# EasyEDA Pro project schematic of PCB.epro

# Schematic DESKPET
Board Name: DESKPET; Create Date: 2025-02-04; Page Name: Sheet_1; Project Name: DESKPET_2025-02-04_14-17-01; Schematic Name: DESKPET; Update Date: 2025-02-19; Company: EasyEDA.com; Page Size: A1; Version: V1.0
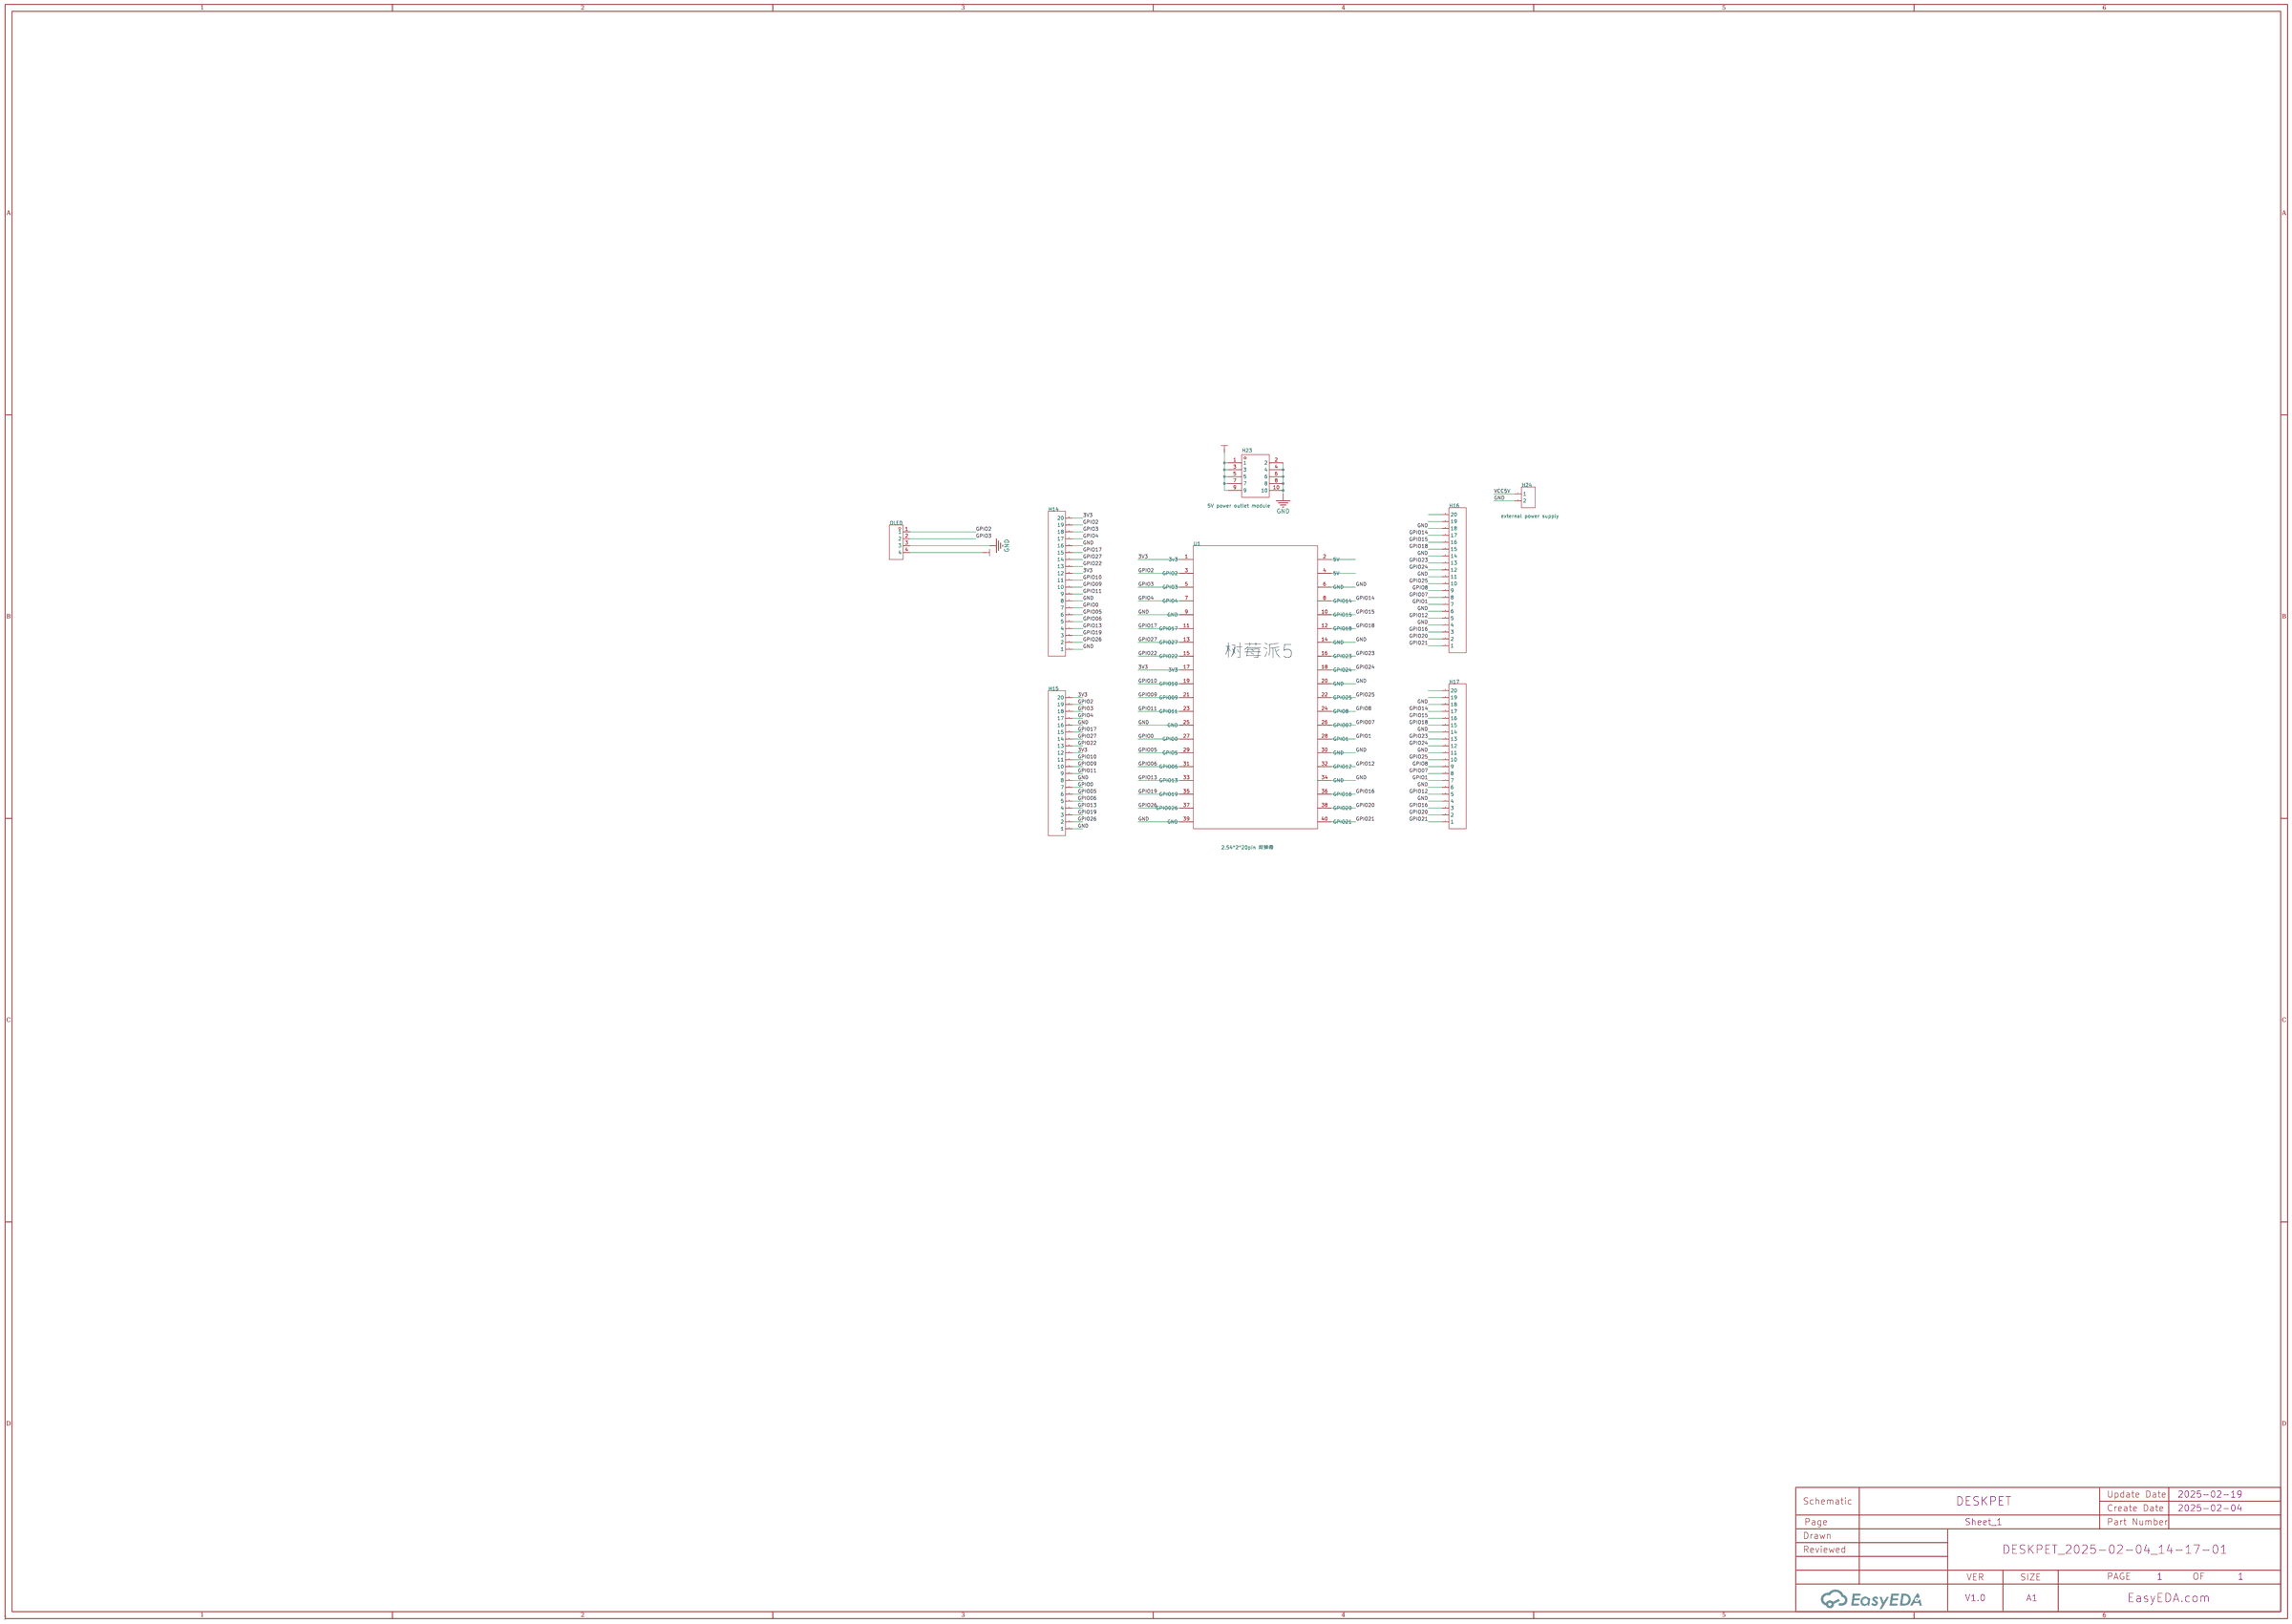
[diagram p0: schematic sheet]

## Parts
H3  OLED  [HDR-TH_4P-P2.54-V-F]
H14  -  [HDR-TH_20P-P2.54-V-F]
H15  -  [HDR-TH_20P-P2.54-V-F]
H16  -  [HDR-TH_20P-P2.54-V-F]
H17  -  [HDR-TH_20P-P2.54-V-F]
H23  5V power outlet module  [HDR-TH_10P-P2.54-V-M-R2-C5-S2.54]
H24  external power supply  [HDR-TH_2P-P2.54-V-F]
U1  2.54*2*20pin 双排母  [raspberripi5]

## Library data of the parts
H3 = 2.54-1*4P母: Holes Structure:1x4P Pitch:2.54mm Row Spacing:- Circular Hole / Square Hole:Square Holes Mounting Type:Straight Number of Rows:Plugin Number of Holes:4P Current Rating (Max):3A Voltage Rating (Max):- Holes Direction:Top Insulation Height:- Contact Materia; LCSC Part Name: 间距:2.54mm 1x4P 直插; Supplier Part: C2718488; Manufacturer: BOOMELE(博穆精密); Supplier Footprint: 插件,P=2.54mm; JLCPCB Part Class: 扩展库; Datasheet: https://atta.szlcsc.com/upload/public/pdf/source/20210301/C2718488_F4427B881E42CAA8DDB0B1C12B3A522C.pdf; Supplier: LCSC; Holes Structure: 1x4P; Pitch: 2.54mm; Circular Hole / Square Hole: Square Holes; Mounting Type: Straight; Number of Rows: Plugin; Number of Holes: 4P; Current Rating (Max): 3A; Holes Direction: Top; Contact Material: bronze; Operating Temperature Range: -40℃~+105℃
H14-H17 = HDR-F_2.54_1x20P: Supplier Part: C50984; Supplier Footprint: 插件
H23 = HDR-M_2.54_2x5: Supplier Part: C124387; Supplier Footprint: 插件,P=2.54mm
H24 = HDR-F_2.54_1x2P: Supplier Part: C49661; Supplier Footprint: 插件
U1 = Rasperberry 5 GPIO

## Nets
3V3: H3.4 H14.12 H14.20 H15.12 H15.20 U1.1(3v3) U1.17(3V3)
5V: H23.1 H23.3 H23.5 H23.7 H23.9
GND: H3.3 H14.1 H14.8 H14.16 H15.1 H15.8 H15.16 H16.4 H16.6 H16.11 H16.14 H16.18 H17.4 H17.6 H17.11 H17.14 H17.18 H23.2 H23.4 H23.6 H23.8 H23.10 H24.2 U1.6(GND) U1.9(GND) U1.14(GND) U1.20(GND) U1.25(GND) U1.30(GND) U1.34(GND) U1.39(GND)
VCC5V: H24.1
GPIO0: H14.7 H15.7 U1.27(GPIO0)
GPIO1: H16.7 H17.7 U1.28(GPIO1)
GPIO2: H3.1 H14.19 H15.19 U1.3(GPIO2)
GPIO3: H3.2 H14.18 H15.18 U1.5(GPIO3)
GPIO4: H14.17 H15.17 U1.7(GPIO4)
GPIO05: H14.6 H15.6 U1.29(GPIO5)
GPIO06: H14.5 H15.5 U1.31(GPIO06)
GPIO07: H16.8 H17.8 U1.26(GPIO07)
GPIO8: H16.9 H17.9 U1.24(GPIO8)
GPIO09: H14.10 H15.10 U1.21(GPIO09)
GPIO10: H14.11 H15.11 U1.19(GPIO10)
GPIO11: H14.9 H15.9 U1.23(GPIO11)
GPIO12: H16.5 H17.5 U1.32(GPIO12)
GPIO13: H14.4 H15.4 U1.33(GPIO13)
GPIO14: H16.17 H17.17 U1.8(GPIO14)
GPIO15: H16.16 H17.16 U1.10(GPIO15)
GPIO16: H16.3 H17.3 U1.36(GPIO16)
GPIO17: H14.15 H15.15 U1.11(GPIO17)
GPIO18: H16.15 H17.15 U1.12(GPIO18)
GPIO19: H14.3 H15.3 U1.35(GPIO19)
GPIO20: H16.2 H17.2 U1.38(GPIO20)
GPIO21: H16.1 H17.1 U1.40(GPIO21)
GPIO22: H14.13 H15.13 U1.15(GPIO22)
GPIO23: H16.13 H17.13 U1.16(GPIO23)
GPIO24: H16.12 H17.12 U1.18(GPIO24)
GPIO25: H16.10 H17.10 U1.22(GPIO25)
GPIO26: H14.2 H15.2 U1.37(GPIO026)
GPIO27: H14.14 H15.14 U1.13(GPIO27)

Not connected (* = marked no-connect by the designer): H16 19 20; H17 19 20; U1 2(5V) 4(5V)

## Notes on the sheet
- 树莓派5

# Board PCB1
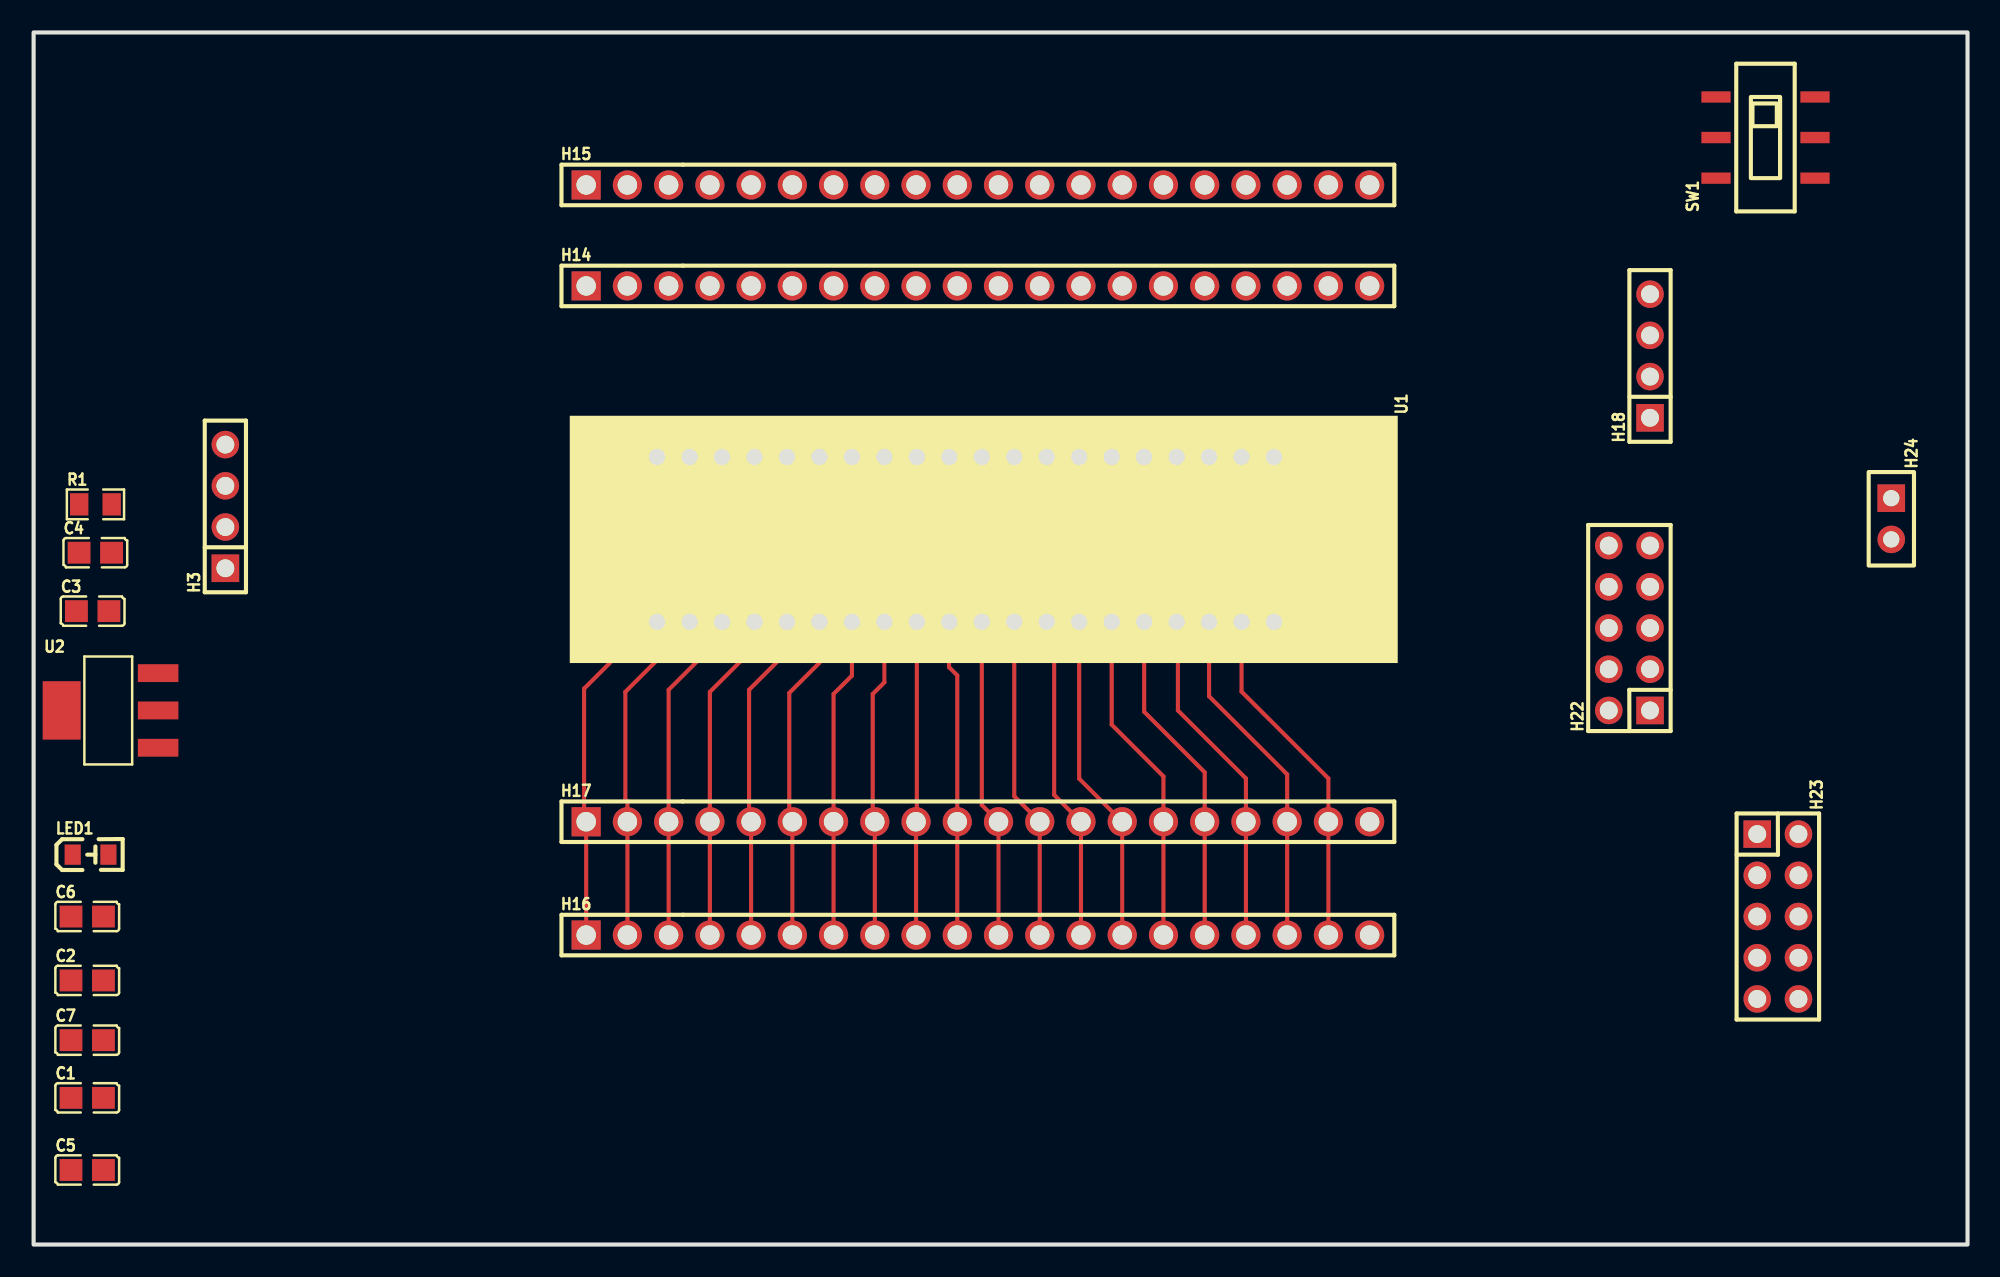
[diagram p1: board, top side]
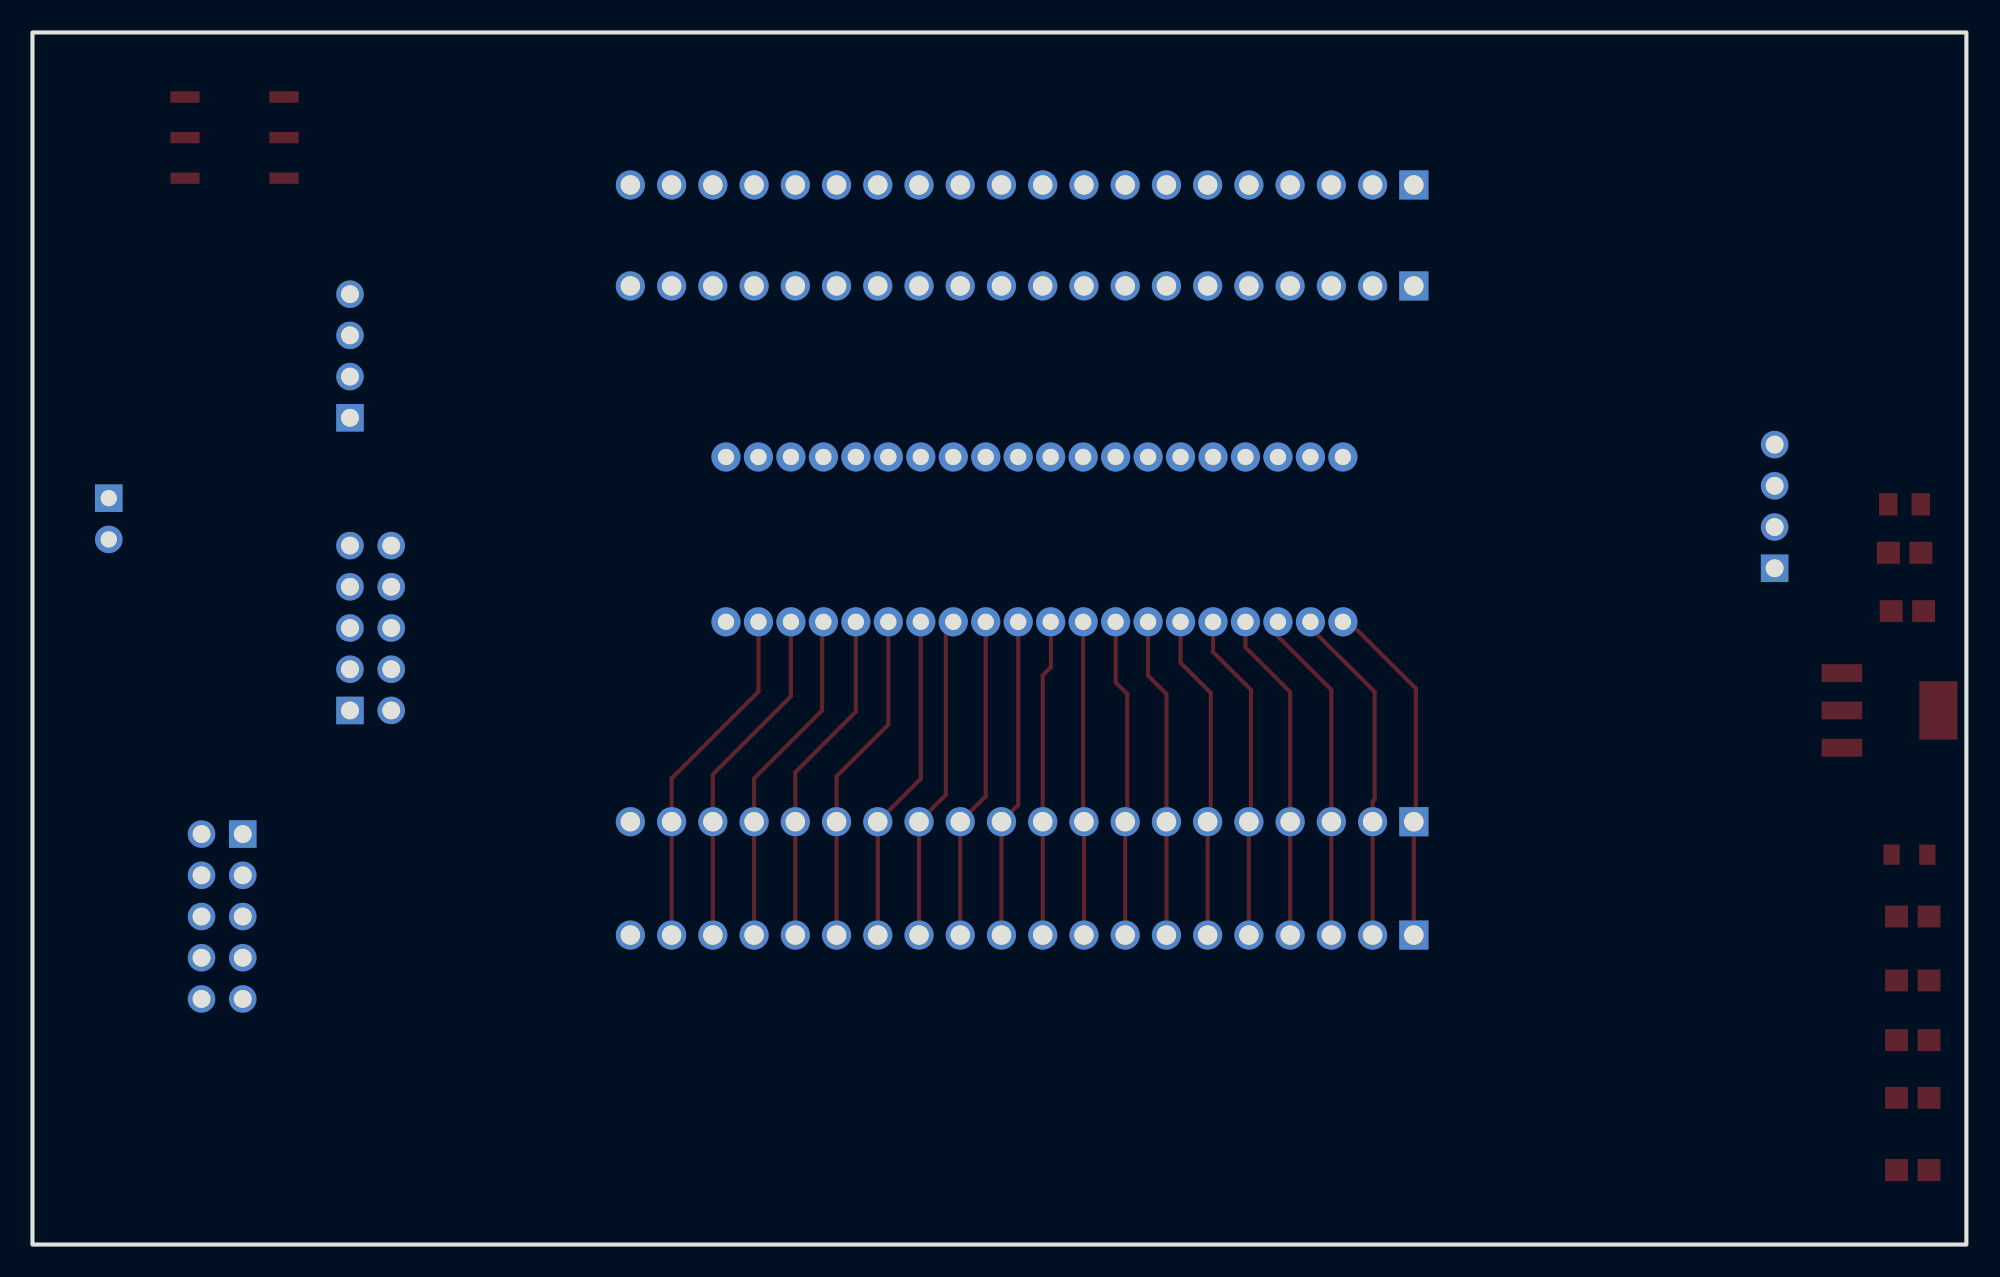
[diagram p2: board, bottom side, seen from below]

Outline 119.13 x 74.7 mm; copper layers: Top Layer, Bottom Layer. Coordinates in mm from the lower left corner of the outline.
Outline path: rectangle 0,74.7 119.13,0
Stack: Top Layer 0.035mm / Dielectric1 1.51mm FR4 er 4.5 / Bottom Layer 0.035mm

## Design rules (mm)
template: JLCPCB Capability(Two Layers Board)
spacing copperThickness1oz (default): track to track 0.102, other pairs 0.152 to 0.3
spacing copperThickness2oz: track to track 0.203, other pairs 0.152 to 0.3
track width copperThickness1oz (default): min 0.127, default 0.254, max 2.54
track width copperThickness2oz: min 0.203, default 0.254, max 2.54
differential pair differentialPair (default): width min 0.127, default 0.254, max 2.54; gap min 0.152, default 0.152
via viaSize (default): diameter min 0.5, default 0.61, max 10; hole min 0.3, default 0.305, max 6.3

## Placement (name value [footprint] x y rotation side)
C1  10UF  [C0805]  3.3 9.04 0 top
C2  100nF  [C0805]  3.3 16.28 0 top
C3  100nF  [C0805]  3.64 39.04 0 top
C4  10UF  [C0805]  3.8 42.64 0 top
C5  10UF  [C0805]  3.3 4.59 0 top
C6  10UF  [C0805]  3.3 20.22 0 top
C7  10UF  [C0805]  3.3 12.6 0 top
H3  OLED  [HDR-TH_4P-P2.54-V-F]  11.81 45.49 90 top
H14  -  [HDR-TH_20P-P2.54-V-F]  58.17 59.08 0 top
H15  -  [HDR-TH_20P-P2.54-V-F]  58.17 65.3 0 top
H16  -  [HDR-TH_20P-P2.54-V-F]  58.17 19.07 0 top
H17  -  [HDR-TH_20P-P2.54-V-F]  58.17 26.06 0 top
H18  su-03T speaking module  [HDR-TH_4P-P2.54-V-F]  99.57 54.76 90 top
H22  3.3V outlet module  [HDR-TH_10P-P2.54-V-M-R2-C5-S2.54]  98.3 38 90 top
H23  5V power outlet module  [HDR-TH_10P-P2.54-V-M-R2-C5-S2.54]  107.44 20.22 270 top
H24  external power supply  [HDR-TH_2P-P2.54-V-F]  114.43 44.73 270 top
LED1  -  [LED_0805]  3.56 24.03 0 top
R1  10K  [R0805]  3.81 45.62 0 top
SW1  SS-3235S-L1  [SW-SMD_SS-3235S-LX]  106.68 68.22 90 top
U1  2.54*2*20pin 双排母  [raspberripi5]  23.07 63.78 270 top
U2  AMS1117-3.3  [SOT-223-3_L6.5-W3.4-P2.30-LS7.0-BR]  4.7 32.92 0 top

## Footprints (pads in the part's own frame, mm; a bottom-side part is the same pattern mirrored in y, then rotated)
C0805
  rect 1.41x1.35 smd: 1(-1,0) 2(1,0)
HDR-TH_2P-P2.54-V-F
  rect 1.7x1.7 hole 1: 1(-1.27,0)
  round 1.7 hole 1: 2(1.27,0)
HDR-TH_4P-P2.54-V-F
  rect 1.7x1.7 hole 1.1: 1(-3.81,0)
  round 1.7 hole 1.1: 2(-1.27,0) 3(1.27,0) 4(3.81,0)
HDR-TH_10P-P2.54-V-M-R2-C5-S2.54
  rect 1.7x1.7 hole 1.1: 1(-5.08,-1.27)
  round 1.7 hole 1.1: 2(-5.08,1.27) 3(-2.54,-1.27) 4(-2.54,1.27) 5(0,-1.27) 6(0,1.27) 7(2.54,-1.27) 8(2.54,1.27) 9(5.08,-1.27) 10(5.08,1.27)
HDR-TH_20P-P2.54-V-F
  rect 1.8x1.8 hole 1.2: 1(-24.13,0)
  round 1.8 hole 1.2: 2(-21.59,0) 3(-19.05,0) 4(-16.51,0) 5(-13.97,0) 6(-11.43,0) 7(-8.89,0) 8(-6.35,0) 9(-3.81,0) 10(-1.27,0) 11(1.27,0) 12(3.81,0) 13(6.35,0) 14(8.89,0) 15(11.43,0) 16(13.97,0) 17(16.51,0) 18(19.05,0) 19(21.59,0) 20(24.13,0)
LED_0805
  rect 1x1.25 smd: 1(-1.15,0.005) 2(1.05,0.005)
R0805
  rect 1.133x1.377 smd: 1(-1,0) 2(1,0)
raspberripi5
  round 1.8 hole 1: 1(15.24,53.34) 2(25.4,53.34) 3(15.24,51.34) 4(25.4,51.34) 5(15.24,49.34) 6(25.4,49.34) 7(15.24,47.34) 8(25.4,47.34) 9(15.24,45.34) 10(25.4,45.34) 11(15.24,43.34) 12(25.4,43.34) 13(15.24,41.34) 14(25.4,41.34) 15(15.24,39.34) 16(25.4,39.34) 17(15.24,37.34) 18(25.4,37.34) 19(15.24,35.34) 20(25.4,35.34) 21(15.24,33.34) 22(25.4,33.34) 23(15.24,31.34) 24(25.4,31.34) 25(15.24,29.34) 26(25.4,29.34) 27(15.24,27.34) 28(25.4,27.34) 29(15.24,25.34) 30(25.4,25.34) 31(15.24,23.34) 32(25.4,23.34) 33(15.24,21.34) 34(25.4,21.34) 35(15.24,19.34) 36(25.4,19.34) 37(15.24,17.34) 38(25.4,17.34) 39(15.24,15.34) 40(25.4,15.34)
SOT-223-3_L6.5-W3.4-P2.30-LS7.0-BR
  rect 2.5x1.1 smd: 1(2.97,-2.3) 2(2.97,0) 3(2.97,2.3)
  rect 2.34x3.6 smd: 4(-2.97,0)
SW-SMD_SS-3235S-LX
  rect 0.7x1.8 smd: 1(-2.5,3.05) 2(0,3.05) 3(2.5,3.05) 4(-2.5,-3.05) 5(0,-3.05) 6(2.5,-3.05)

## Nets
3.3V: C3.2 C4.2 H3.4 H22.1 H22.3 H22.5 H22.7 H22.9 R1.1 U2.2 U2.4
3V3: H14.12 H14.20 H15.12 H15.20 U1.1 U1.17
5V: C1.2 C2.2 C5.2 C6.2 C7.2 H16.19 H16.20 H17.19 H17.20 H18.4 H23.1 H23.3 H23.5 H23.7 H23.9 SW1.5 SW1.6 U1.2 U1.4 U2.3
GND: C1.1 C2.1 C3.1 C4.1 C5.1 C6.1 C7.1 H3.3 H14.1 H14.8 H14.16 H15.1 H15.8 H15.16 H16.4 H16.6 H16.11 H16.14 H16.18 H17.4 H17.6 H17.11 H17.14 H17.18 H18.1 H22.2 H22.4 H22.6 H22.8 H22.10 H23.2 H23.4 H23.6 H23.8 H23.10 H24.2 LED1.1 SW1.1 SW1.2 SW1.3 U1.6 U1.9 U1.14 U1.20 U1.25 U1.30 U1.34 U1.39 U2.1
VCC5V: H24.1 SW1.4
GPIO0: H14.7 H15.7 U1.27
GPIO1: H16.7 H17.7 U1.28
GPIO2: H3.1 H14.19 H15.19 U1.3
GPIO3: H3.2 H14.18 H15.18 U1.5
GPIO4: H14.17 H15.17 U1.7
GPIO05: H14.6 H15.6 U1.29
GPIO06: H14.5 H15.5 U1.31
GPIO07: H16.8 H17.8 U1.26
GPIO8: H16.9 H17.9 U1.24
GPIO09: H14.10 H15.10 U1.21
GPIO10: H14.11 H15.11 U1.19
GPIO11: H14.9 H15.9 U1.23
GPIO12: H16.5 H17.5 U1.32
GPIO13: H14.4 H15.4 U1.33
GPIO14: H16.17 H17.17 H18.2 U1.8
GPIO15: H16.16 H17.16 H18.3 U1.10
GPIO16: H16.3 H17.3 U1.36
GPIO17: H14.15 H15.15 U1.11
GPIO18: H16.15 H17.15 U1.12
GPIO19: H14.3 H15.3 U1.35
GPIO20: H16.2 H17.2 U1.38
GPIO21: H16.1 H17.1 U1.40
GPIO22: H14.13 H15.13 U1.15
GPIO23: H16.13 H17.13 U1.16
GPIO24: H16.12 H17.12 U1.18
GPIO25: H16.10 H17.10 U1.22
GPIO26: H14.2 H15.2 U1.37
GPIO27: H14.14 H15.14 U1.13
$1N6172: LED1.2 R1.2

## Routing (per net, layer and track width the routed paths; a pad name or vN(x,y) marks a point on that pad's centre or on a via; arc(x,y) is an arc through that point)
5V: length 21.5
  Top Layer w0.254: H16.19 H17.19 79.76,28.72 74.41,34.07 U1.4
GND: length 102
  Top Layer w0.254: H16.6 H17.6 46.55,26.25 46.55,34 48.41,35.86 U1.30 ; H16.14 H17.14 64.41,28.71 U1.14 ; U1.6 72.41,33.79 77.22,28.98 H17.18 H16.18 ; H16.4 H17.4 41.66,34.06 44.41,36.81 U1.34 ; U1.20 58.41,27.09 H17.11 H16.11
VCC5V: length 0.1
  Top Layer w0.254: 110.24,65.72 110.24,65.81
GPIO1: length 19.8
  Top Layer w0.254: U1.28 50.41,35.06 49.28,33.93 H17.7 H16.7
GPIO07: length 19.7
  Top Layer w0.254: U1.26 52.41,34.65 51.69,33.93 51.69,26.18 H17.8 H16.8
GPIO8: length 19.3
  Top Layer w0.254: H16.9 H17.9 54.41,26.11 U1.24
GPIO12: length 20.3
  Top Layer w0.254: H16.5 H17.5 44.07,26.18 44.07,34.19 46.41,36.52 U1.32
GPIO14: length 21.1
  Top Layer w0.254: U1.8 70.48,38.3 70.48,32.92 74.68,28.72 H17.17 H16.17
GPIO15: length 20.8
  Top Layer w0.254: U1.10 68.41,32.84 72.14,29.11 H17.16 H16.16
GPIO16: length 20.7
  Top Layer w0.254: U1.36 42.41,37.48 39.12,34.19 H17.3 H16.3
GPIO18: length 20.6
  Top Layer w0.254: U1.12 66.41,32.04 69.6,28.85 H17.15 H16.15
GPIO20: length 21
  Top Layer w0.254: U1.38 40.41,38.02 36.45,34.06 36.45,27.44 36.58,27.31 H17.2 H16.2
GPIO21: length 21.4
  Top Layer w0.254: H16.1 H17.1 33.91,26.18 33.91,34.26 38.03,38.38 U1.40
GPIO23: length 20.2
  Top Layer w0.254: U1.16 62.86,37.92 62.86,27.71 H17.13 H16.13
GPIO24: length 20
  Top Layer w0.254: U1.18 60.41,27.63 H17.12 H16.12
GPIO25: length 19.5
  Top Layer w0.254: H16.10 H17.10 56.9,35.07 56.39,35.58 56.39,38.36 U1.22
